# EAGLE design board (EAGLE 6.4)
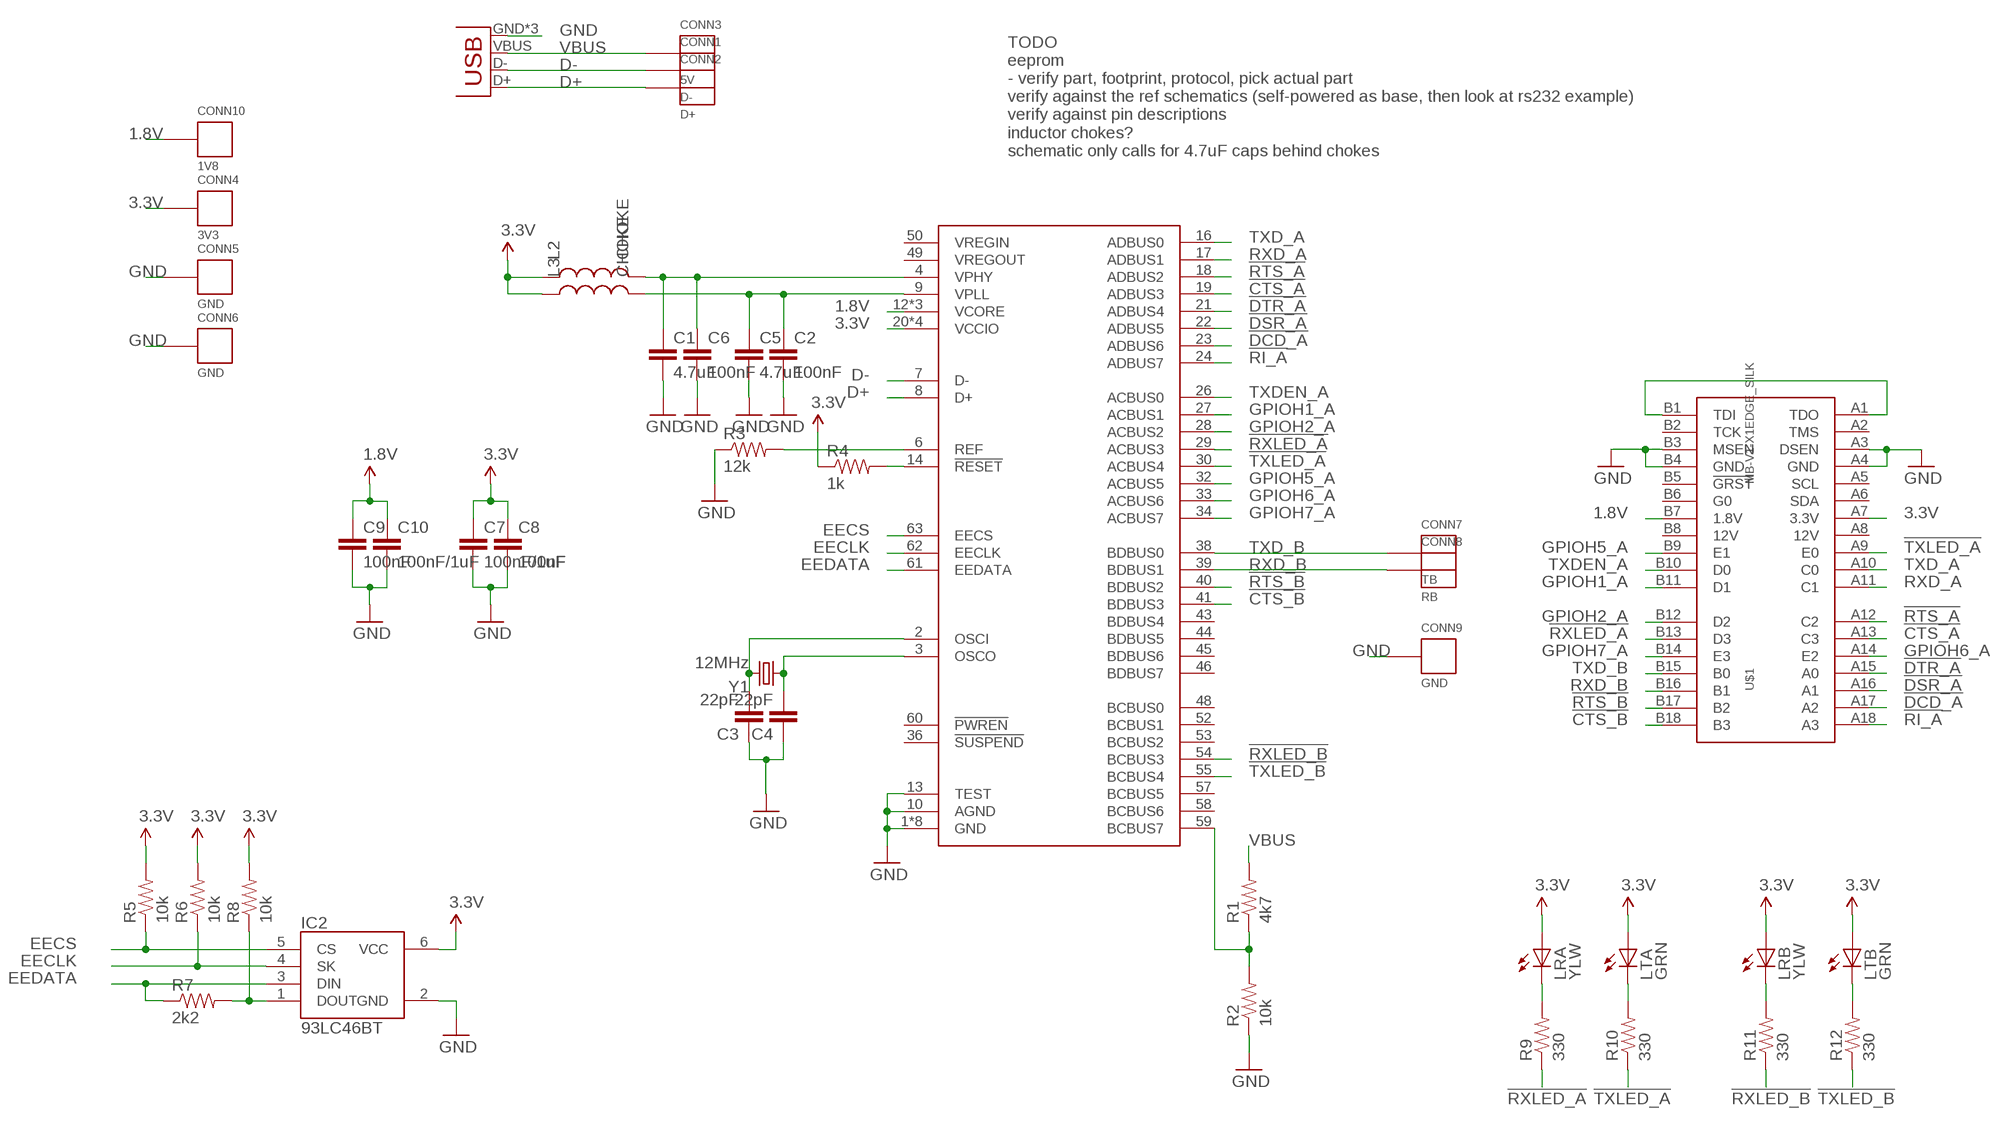
[diagram p0: schematic, sheet 1]

## Parts
C1  4.7uF  CAP0805  [0805]
C2  100nF  CAP0402-CAP  [0402-CAP]
C3  22pF  CAP0402-CAP  [0402-CAP]
C4  22pF  CAP0402-CAP  [0402-CAP]
C5  4.7uF  CAP0805  [0805]
C6  100nF  CAP0402-CAP  [0402-CAP]
C7  100nF/1uF  CAP0402-CAP  [0402-CAP]
C8  100nF  CAP0402-CAP  [0402-CAP]
C9  100nF  CAP0402-CAP  [0402-CAP]
C10  100nF/1uF  CAP0402-CAP  [0402-CAP]
CONN1  D-  CONNECTOR1.27  [TESTPAD-1.27]
CONN2  D+  CONNECTOR1.27  [TESTPAD-1.27]
CONN3  5V  CONNECTOR1.27  [TESTPAD-1.27]
CONN4  3V3  CONNECTOR22AWG  [HOLE_22AWG]
CONN5  GND  CONNECTOR22AWG  [HOLE_22AWG]
CONN6  GND  CONNECTORCLIP  [CLIP-AREA]
CONN7  TB  CONNECTOR22AWG  [HOLE_22AWG]
CONN8  RB  CONNECTOR22AWG  [HOLE_22AWG]
CONN9  GND  CONNECTOR22AWG  [HOLE_22AWG]
CONN10  1V8  CONNECTOR22AWG  [HOLE_22AWG]
IC1  FT2232HL  [TQFP64_LONGPAD]
IC2  93LC46BT  93C46SOT23-6  [SOT23-6L]
JP2  USBMICROB  [USB-MICROB]
L2  CHOKE  INDUCTOR0603  [0603]
L3  CHOKE  INDUCTOR0603  [0603]
LRA  YLW  LED0603  [0603_LED]
LRB  YLW  LED0603  [0603_LED]
LTA  GRN  LED0603  [0603_LED]
LTB  GRN  LED0603  [0603_LED]
R1  4k7  RESISTOR0603  [0603-RES]
R2  10k  RESISTOR0603  [0603-RES]
R3  12k  RESISTOR0603  [0603-RES]
R4  1k  RESISTOR0603  [0603-RES]
R5  10k  RESISTOR0603  [0603-RES]
R6  10k  RESISTOR0603  [0603-RES]
R7  2k2  RESISTOR0603  [0603-RES]
R8  10k  RESISTOR0603  [0603-RES]
R9  330  RESISTOR0603  [0603-RES]
R10  330  RESISTOR0603  [0603-RES]
R11  330  RESISTOR0603  [0603-RES]
R12  330  RESISTOR0603  [0603-RES]
U$1  MB-V1-X1EDGE_SILK  [MB-V1-X1-EDGE]
Y1  12MHz  CRYSTALHC49US  [HC49US]

## Nets
1.8V: C9.1 C10.1 CONN10.P IC1.12(VCORE) IC1.37(VCORE) IC1.64(VCORE) U$1.B7(1.8V)
3.3V: C7.1 C8.1 CONN4.P IC1.20(VCCIO) IC1.31(VCCIO) IC1.42(VCCIO) IC1.56(VCCIO) IC2.6(VCC) L2.1 L3.1 LRA.A LRB.A LTA.A LTB.A R4.1 R5.2 R6.2 R8.2 U$1.A7(3.3V)
!CTS_A: IC1.19(ADBUS3) U$1.A13(C3)
!CTS_B: IC1.41(BDBUS3) U$1.B18(B3)
!DCD_A: IC1.23(ADBUS6) U$1.A17(A2)
!DSR_A: IC1.22(ADBUS5) U$1.A16(A1)
!DTR_A: IC1.21(ADBUS4) U$1.A15(A0)
!RI_A: IC1.24(ADBUS7) U$1.A18(A3)
!RTS_A: IC1.18(ADBUS2) U$1.A12(C2)
!RTS_B: IC1.40(BDBUS2) U$1.B17(B2)
!RXLED_A: IC1.29(ACBUS3) R9.1 U$1.B13(D3)
!RXLED_B: IC1.54(BCBUS3) R11.1
!TXLED_A: IC1.30(ACBUS4) R10.1 U$1.A9(E0)
!TXLED_B: IC1.55(BCBUS4) R12.1
D+: CONN2.P IC1.8(D+) JP2.D+
D-: CONN1.P IC1.7(D-) JP2.D-
EECLK: IC1.62(EECLK) IC2.4(SK) R6.1
EECS: IC1.63(EECS) IC2.5(CS) R5.1
EEDATA: IC1.61(EEDATA) IC2.3(DIN) R7.1
GND: C1.2 C2.2 C3.1 C4.1 C5.2 C6.2 C7.2 C8.2 C9.2 C10.2 CONN5.P CONN6.P$1(P) CONN6.P$2(P) CONN9.P IC1.1(GND) IC1.5(GND) IC1.10(AGND) IC1.11(GND) IC1.13(TEST) IC1.15(GND) IC1.25(GND) IC1.35(GND) IC1.47(GND) IC1.51(GND) IC2.2(GND) JP2.GND JP2.MT1(GND) JP2.MT2(GND) R2.1 R3.1 U$1.A3(DSEN) U$1.A4(GND) U$1.B3(MSEN) U$1.B4(GND)
GPIOH1_A: IC1.27(ACBUS1) U$1.B11(D1)
GPIOH2_A: IC1.28(ACBUS2) U$1.B12(D2)
GPIOH5_A: IC1.32(ACBUS5) U$1.B9(E1)
GPIOH6_A: IC1.33(ACBUS6) U$1.A14(E2)
GPIOH7_A: IC1.34(ACBUS7) U$1.B14(E3)
N$1: C3.2 IC1.2(OSCI) Y1.2
N$2: C4.2 IC1.3(OSCO) Y1.1
N$3: IC1.59(BCBUS7) R1.1 R2.2
N$4: IC1.6(REF) R3.2
N$5: C1.1 C6.1 IC1.4(VPHY) L2.2
N$6: IC1.14(!RESET) R4.2
N$7: C2.1 C5.1 IC1.9(VPLL) L3.2
N$8: IC2.1(DOUT) R7.2 R8.1
N$9: LRA.C R9.2
N$10: LTA.C R10.2
N$11: LRB.C R11.2
N$12: LTB.C R12.2
N$13: U$1.A1(TDO) U$1.B1(TDI)
RXD_A: IC1.17(ADBUS1) U$1.A11(C1)
RXD_B: CONN8.P IC1.39(BDBUS1) U$1.B16(B1)
TXD_A: IC1.16(ADBUS0) U$1.A10(C0)
TXD_B: CONN7.P IC1.38(BDBUS0) U$1.B15(B0)
TXDEN_A: IC1.26(ACBUS0) U$1.B10(D0)
VBUS: CONN3.P JP2.VBUS R1.2
Unconnected: IC1.36(!SUSPEND) IC1.43(BDBUS4) IC1.44(BDBUS5) IC1.45(BDBUS6) IC1.46(BDBUS7) IC1.48(BCBUS0) IC1.49(VREGOUT) IC1.50(VREGIN) IC1.52(BCBUS1) IC1.53(BCBUS2) IC1.57(BCBUS5) IC1.58(BCBUS6) IC1.60(!PWREN) U$1.A2(TMS) U$1.A5(SCL) U$1.A6(SDA) U$1.A8(12V) U$1.B2(TCK) U$1.B5(!GRST) U$1.B6(G0) U$1.B8(12V)

## Notes on the sheet
- TODO
  eeprom
  - verify part, footprint, protocol, pick actual part
  verify against the ref schematics (self-powered as base, then look at rs232 example)
  verify against pin descriptions
  inductor chokes?
  schematic only calls for 4.7uF caps behind chokes

## Library data of the parts
C1-C10 = kmod-passives:CAP: Capacitor Standard 0603 ceramic capacitor, and 0.1" leaded capacitor.
CONN1-CONN10 = kmod-nonparts:CONNECTOR: Collection of holes/pads for testing/connecting
IC1 = kmod-testing:FT2232H
IC2 = kmod-testing:93C46: Not sure how standard the SOT23-6 pinout is.
JP2 = kmod-connectors:USB: USB Connectors Got from SparkFun, removed all but MICROB. Used that successfully. no mounting holes; PROD_ID: CONN-09505
L2 L3 = kmod-passives:INDUCTOR
LRA LRB LTA LTB = kmod-passives:LED
R1-R12 = kmod-passives:RESISTOR: Resistor Basic schematic elements and footprints for 0603, 1206, and PTH resistors.
U$1 = kmod-connectors:MB-V1-X1
Y1 = kmod-mechanical:CRYSTAL: Various standard crystals. Proven footprints. Spark Fun Electronics SKU : COM-00534

## Board
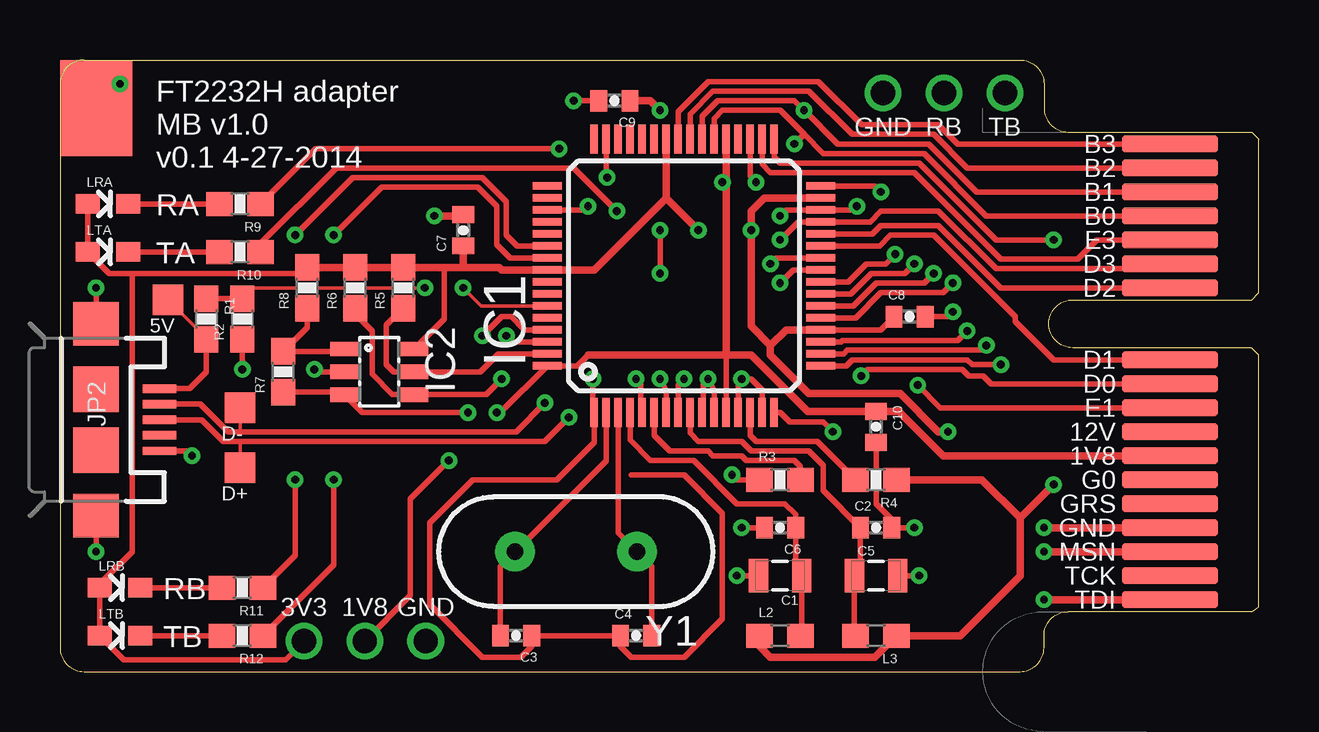
[diagram p1: board, top side]
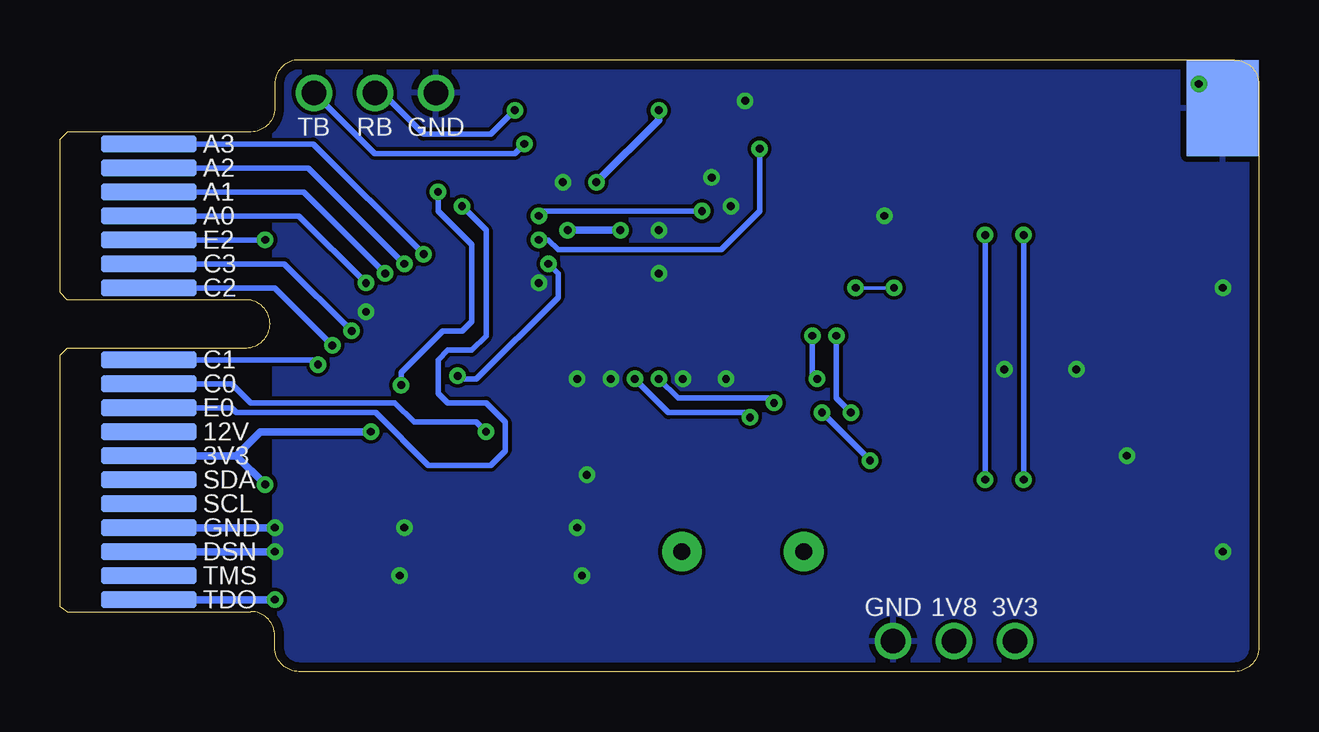
[diagram p2: board, bottom side, seen from below]

Size 49.95 x 25.5 mm. Coordinates in mm from the lower left corner, seen from the top.
Outline: 42,22.5 arc-90 41,23.5 41,24.5 arc90 40,25.5 1,25.5 arc90 0,24.5 0,1 arc90 1,0 40,0 arc90 41,1 41,1.5 arc-90 42,2.5
Copper layers (1*16): Top 0.0356mm / dielectric 1.5011mm / Bottom 0.0356mm
Design rules "OSHPark_mine": minimum track width 6mil, minimum drill 13mil, track to track 6mil, track to pad 6mil, pad to pad 6mil, via to via 6mil, smd to smd 6mil, copper to edge 15mil, drill to drill 6mil, minimum pad ring 7mil, minimum via ring 7mil, stop-mask expansion 2mil, vias tented up to drill 13mil, thermal gap 10mil

### Footprints (pad centres in the part's own frame; a part is rotated, then mirrored left to right if it is on the bottom)
0805 = smd 0.8 x 1.4: 1 -0.9,0; 2 0.9,0
0402-CAP = smd 0.7 x 0.9: 1 -0.65,0; 2 0.65,0
TESTPAD-1.27 = smd 1.27 x 1.27: P 0,0
HOLE_22AWG = drill 1.016: P 0,0
CLIP-AREA = smd 4 x 3: P$1 0,0 | smd 4 x 3 bottom: P$2 0,0
TQFP64_LONGPAD = smd 1.2 x 0.3: 1 -5.7,3.75; 2 -5.7,3.25; 3 -5.7,2.75; 4 -5.7,2.25; 5 -5.7,1.75; 6 -5.7,1.25; 7 -5.7,0.75; 8 -5.7,0.25; 9 -5.7,-0.25; 10 -5.7,-0.75; 11 -5.7,-1.25; 12 -5.7,-1.75; 13 -5.7,-2.25; 14 -5.7,-2.75; 15 -5.7,-3.25; 16 -5.7,-3.75; 33 5.7,-3.75; 34 5.7,-3.25; 35 5.7,-2.75; 36 5.7,-2.25; 37 5.7,-1.75; 38 5.7,-1.25; 39 5.7,-0.75; 40 5.7,-0.25; 41 5.7,0.25; 42 5.7,0.75; 43 5.7,1.25; 44 5.7,1.75; 45 5.7,2.25; 46 5.7,2.75; 47 5.7,3.25; 48 5.7,3.75 | smd 0.3 x 1.2: 17 -3.75,-5.7; 18 -3.25,-5.7; 19 -2.75,-5.7; 20 -2.25,-5.7; 21 -1.75,-5.7; 22 -1.25,-5.7; 23 -0.75,-5.7; 24 -0.25,-5.7; 25 0.25,-5.7; 26 0.75,-5.7; 27 1.25,-5.7; 28 1.75,-5.7; 29 2.25,-5.7; 30 2.75,-5.7; 31 3.25,-5.7; 32 3.75,-5.7; 49 3.75,5.7; 50 3.25,5.7; 51 2.75,5.7; 52 2.25,5.7; 53 1.75,5.7; 54 1.25,5.7; 55 0.75,5.7; 56 0.25,5.7; 57 -0.25,5.7; 58 -0.75,5.7; 59 -1.25,5.7; 60 -1.75,5.7; 61 -2.25,5.7; 62 -2.75,5.7; 63 -3.25,5.7; 64 -3.75,5.7
SOT23-6L = smd 0.6 x 1.2: 1 -0.95,-1.45; 2 0,-1.45; 3 0.95,-1.45; 4 0.95,1.45; 5 0,1.45; 6 -0.95,1.45
USB-MICROB = smd 0.35 x 1.4: D+ 0,2.65; D- -0.65,2.65; GND 1.3,2.65; ID 0.65,2.65; VBUS -1.3,2.65 | smd 1.8 x 1.9: MT1 -4,0; MT2 4,0 | smd 1.9 x 1.9: P$1 -1.27,0; P$2 1.27,0
0603 = smd 1.1 x 1: 1 -0.85,0; 2 0.85,0
0603_LED = smd 0.8 x 1.003: A 0,-0.852; C 0,0.852
0603-RES = smd 1.1 x 1: 1 -0.85,0; 2 0.85,0
MB-V1-X1-EDGE = smd 0.7 x 4 bottom: A1 -11.5,-0.75; A2 -10.5,-0.75; A3 -9.5,-0.75; A4 -8.5,-0.75; A5 -7.5,-0.75; A6 -6.5,-0.75; A7 -5.5,-0.75; A8 -4.5,-0.75; A9 -3.5,-0.75; A10 -2.5,-0.75; A11 -1.5,-0.75; A12 1.5,-0.75; A13 2.5,-0.75; A14 3.5,-0.75; A15 4.5,-0.75; A16 5.5,-0.75; A17 6.5,-0.75; A18 7.5,-0.75 | smd 0.7 x 4: B1 -11.5,-0.75; B2 -10.5,-0.75; B3 -9.5,-0.75; B4 -8.5,-0.75; B5 -7.5,-0.75; B6 -6.5,-0.75; B7 -5.5,-0.75; B8 -4.5,-0.75; B9 -3.5,-0.75; B10 -2.5,-0.75; B11 -1.5,-0.75; B12 1.5,-0.75; B13 2.5,-0.75; B14 3.5,-0.75; B15 4.5,-0.75; B16 5.5,-0.75; B17 6.5,-0.75; B18 7.5,-0.75
HC49US = drill 0.7 pad 1.651: 1 -2.54,0; 2 2.54,0

### Placement (x,y rotation side)
C1  30,4 180 top
C2  34,6 0 top
C3  19,1.5 180 top
C4  24,1.5 0 top
C5  34,4 0 top
C6  30,6 180 top
C7  16.8,18.4 90 top
C8  35.4,14.8 0 top
C9  23.1,23.8 180 top
C10  34,10.2 270 top
CONN1  7.5,11 0 top
CONN2  7.5,8.5 0 top
CONN3  4.5,15.5 0 top
CONN4  10.16,1.27 180 top
CONN5  15.24,1.27 180 top
CONN6  1.5,23.5 90 top
CONN7  39.37,24.13 0 top
CONN8  36.83,24.13 0 top
CONN9  34.29,24.13 0 top
CONN10  12.7,1.27 180 top
IC1  26,16.5 90 top
IC2  13.3,12.5 270 top
JP2  1.5,10.5 270 top
L2  30,1.5 0 top
L3  34,1.5 180 top
LRA  2,19.5 270 top
LRB  2.5,3.5 270 top
LTA  2,17.5 270 top
LTB  2.5,1.5 270 top
R1  6.1,14.7 270 top
R2  7.6,14.7 90 top
R3  30,8 0 top
R4  34,8 180 top
R5  14.3,16 90 top
R6  12.3,16 90 top
R7  9.3,12.5 90 top
R8  10.3,16 90 top
R9  7.5,19.5 180 top
R10  7.5,17.5 180 top
R11  7.6,3.5 180 top
R12  7.6,1.5 180 top
U$1  45.5,14.5 90 top
Y1  21.5,5 180 top

### Tracks (layer width: path | path; a pad name or v marks a point on that pad's centre or on a via)
1.8V  (via drill 0.33)
  Top 0.229: IC1.12 27.75,13.15 27.8,13.2 | 22,13.2 21.55,12.75 IC1.64 18.35,10.8 v18.2,10.8 | v16.2,8.8 14.6,7.2 14.6,3.17 CONN10.P
  Top 0.305: U$1.B7 36.8,9 34.95,10.85 C10.1 31.15,10.85 28.8,13.2 27.8,13.2 | 27.8,13.2 22,13.2 | 27.8,13.2 27.75,13.25 27.75,20.47 | IC1.37 27.75,20.47 | 27.75,20.47 27.68,20.4 v27.6,20.4 | v25,23.4 24.6,23.8 C9.1
  Bottom 0.229: v18.2,10.8 v16.2,8.8
  Bottom 0.305: v27.6,20.4 25,23 v25,23.4
3.3V  (via drill 0.33)
  Top 0.229: IC1.20 34.2,14.25 C8.1 | IC2.6 16.01,14.71 16.01,16.84 | LRA.A LTA.A 2.05,16.6 3,16.6 | R8.2 10.05,16.6 3,16.6 | 3,16.6 3,5 1.65,3.65 LRB.A LTB.A 2.65,0.5 9.4,0.5 CONN4.P
  Top 0.305: IC1.20 30.25,14.25 29.6,13.6 | 29.6,13.6 29.6,13.2 31.2,11.6 35,11.6 36.6,10 v37,10 | v41.4,7.8 40,6.4 | 40,6.4 40,4 37.5,1.5 L3.1 33.95,0.6 29.6,0.6 29.15,1.05 L2.1 | 29.6,13.6 28.8,14.4 v28.8,18.4 28.8,19.2 29.35,19.75 IC1.31 | v26.6,18.4 25.25,19.75 | 25.25,19.75 IC1.42 | 25.25,19.75 22.25,16.75 IC1.56 18.4,16.75 18.31,16.84 16.8,16.84 | R8.2 R6.2 R5.2 15.7,16.85 16.01,16.84 16.8,16.84 | 40,6.4 38.4,8 R4.1 | C7.1 16.8,16.84
  Bottom 0.305: 42.6,9 U$1.A7 | 42.6,9 v41.4,7.8 | v28.8,18.4 v26.6,18.4 | 42.6,9 41.6,10 v37,10
!CTS_A  (via drill 0.33)
  Top 0.229: IC1.19 32.55,13.75 32.6,13.8 37.4,13.8 v37.8,14.2
  Bottom 0.229: v37.8,14.2 40.6,17 U$1.A13
!CTS_B
  Top 0.229: IC1.41 25.75,23.35 27,24.6 31.6,24.6 33.4,22.8 36.6,22.8 37.4,22 U$1.B18
!DCD_A  (via drill 0.33)
  Top 0.229: IC1.23 32.95,15.75 33.8,16.6 35.2,16.6 v35.6,17
  Bottom 0.229: U$1.A17 39.6,21 v35.6,17
!DSR_A  (via drill 0.33)
  Top 0.229: IC1.22 33.05,15.25 34,16.2 36,16.2 v36.4,16.6
  Bottom 0.229: U$1.A16 39.8,20 v36.4,16.6
!DTR_A  (via drill 0.33)
  Top 0.229: IC1.21 33.15,14.75 34.2,15.8 36.8,15.8 v37.2,16.2
  Bottom 0.229: U$1.A15 40,19 v37.2,16.2
!RI_A  (via drill 0.33)
  Top 0.229: IC1.24 32.85,16.25 33.6,17 34.4,17 v34.8,17.4
  Bottom 0.229: U$1.A18 39.4,22 v34.8,17.4
!RTS_A  (via drill 0.33)
  Top 0.229: IC1.18 32.65,13.25 32.8,13.4 38.4,13.4 v38.6,13.6
  Bottom 0.229: v38.6,13.6 41,16 U$1.A12
!RTS_B
  Top 0.229: IC1.40 26.25,23.25 27.2,24.2 31.2,24.2 33,22.4 36.4,22.4 37.8,21 U$1.B17
!RXLED_A  (via drill 0.33)
  Top 0.229: U$1.B13 46.05,16.8 39,16.8 36.6,19.2 34.2,19.2 33.75,18.75 IC1.29 30.75,18.75 v30,18 | R9.1 10.65,21.8 v20.8,21.8
  Bottom 0.229: v20.8,21.8 20.8,19.2 22.4,17.6 29.2,17.6 29.6,18 v30,18
!RXLED_B  (via drill 0.33)
  Top 0.229: v9.8,18.2 12.2,20.6 17.6,20.6 18.6,19.6 18.6,18.2 19.05,17.75 IC1.54 | v9.8,8 9.8,4.85 R11.1
  Bottom 0.229: v9.8,8 v9.8,18.2
!TXLED_A  (via drill 0.33)
  Top 0.229: v23.2,19.2 21.4,21 11.5,21 8.35,17.85 R10.1 | v30,19 30.25,19.25 IC1.30 33.05,19.25 v33.2,19.4
  Bottom 0.229: v23.2,19.2 29.8,19.2 v30,19 | v33.2,19.4 32.2,18.4 32.2,14 32.8,13.4 33.8,13.4 34.2,13 34.2,11.6 33.8,11.2 32.2,11.2 31.4,10.4 31.4,9.2 32,8.6 34.6,8.6 36.8,10.8 42.6,10.8 42.8,11 U$1.A9
!TXLED_B  (via drill 0.33)
  Top 0.229: v11.4,18.2 13.4,20.2 17.4,20.2 18.2,19.4 18.2,17.8 18.75,17.25 IC1.55 | v11.4,8 11.4,4.45 R12.1
  Bottom 0.229: v11.4,8 v11.4,18.2
D+  (via drill 0.33)
  Top 0.152: CONN2.P 7.5,9.6
  Top 0.229: JP2.D+ 5.9,10.5 6.8,9.6 7.5,9.6 20.2,9.6 v21.2,10.6 | IC1.8 25.75,11.95 v26,12.2
  Bottom 0.229: v26,12.2 24.6,10.8 21.4,10.8 v21.2,10.6
D-  (via drill 0.33)
  Top 0.152: CONN1.P 7.5,10
  Top 0.229: JP2.D- 5.85,11.15 7,10 7.5,10 19,10 v20.2,11.2 | IC1.7 25.25,11.75 v25,12.2
  Bottom 0.229: v20.2,11.2 20.4,11.4 24.2,11.4 v25,12.2
EECLK  (via drill 0.33)
  Top 0.229: R6.1 12.3,14.9 13,14.2 13,12.4 13.85,11.55 IC2.4 17.75,11.55 v18.4,12.2 | IC1.62 18.85,13.75 v18.6,14
  Bottom 0.229: v18.4,12.2 18.6,12.4 v18.6,14
EECS
  Top 0.229: R5.1 13.6,14.45 13.6,12.8 13.9,12.5 IC2.5 17.5,12.5 18.25,13.25 IC1.63
EEDATA  (via drill 0.33)
  Top 0.229: R7.1 11.75,11.65 IC2.3 12.6,10.8 v17,10.8 | IC1.61 19.35,14.25 18.8,14.8 18.4,14.8 v17.6,14
  Bottom 0.229: v17.6,14 17.6,11.4 v17,10.8
GND  (via drill 0.33)
  Top 0.152: CONN6.P$1 v2.5,24.5
  Top 0.229: JP2.MT1 v1.5,16 | JP2.MT2 v1.5,5 | JP2.GND 5.3,9.2 v5.5,9 | 23.8,8.2 26,8.2 27.6,6.6 27.6,2.2 26,0.6 23.8,0.6 23.35,1.05 C4.1 C3.1 19.65,1.05 19.2,0.6 17.6,0.6 15.4,2.8 15.4,6.2 17.2,8 20.7,8 22.25,9.55 IC1.1 22.2,10.85 v22.2,12.2 | IC2.2 10.7,12.5 v10.6,12.6 | IC1.5 24.2,10.85 24.2,12 v24,12.2 | IC1.10 26.8,10.85 26.8,12 v27,12.2 27.25,11.75 IC1.11 | IC1.13 28.25,12.05 v28.4,12.2 28.8,12.2 29.25,11.75 IC1.15 | IC1.35 28.75,20.65 v29,20.4 | IC1.47 22.75,20.65 v22.8,20.6 | IC1.51 21.85,19.25 v22,19.4 | R2.1 v7.6,12.6 | C5.2 v35.8,4 | v35.6,6 C2.2 34.65,6.35 34,7 C10.2 | C6.2 v28.4,6 | C1.2 v28.2,4 | R3.1 28.2,8 v28,8.2 | C8.2 37,14.8 v37.2,15 | v25,18.4 v25,16.6 | IC1.25 30.55,16.75 v30,16.2 | C9.2 v21.4,23.8
  Top 0.305: U$1.B3 v41,5 | U$1.B4 v41,6 | C7.2 16.75,19 v15.6,19
  Bottom 0.152: CONN6.P$1 v2.5,24.5
  Bottom 0.305: v41,6 U$1.B4 | v41,5 U$1.B3
  pour Bottom: 0,25.5 41,25.5 41,0 0,0
GPIOH1_A
  Top 0.229: IC1.27 34.15,17.75 34.6,18.2 36.4,18.2 39.8,14.8 39.8,14.6 41.4,13 U$1.B11
GPIOH2_A
  Top 0.229: U$1.B12 39.2,16 36.6,18.6 34.2,18.6 33.85,18.25 IC1.28
GPIOH5_A  (via drill 0.33)
  Top 0.229: IC1.32 33.95,20.25 v34.2,20 | v35.74,11.94 36.68,11 U$1.B9
  Bottom 0.229: v34.2,20 34.2,19.2 32.8,17.8 32.8,14.6 33.2,14.2 34,14.2 35.74,12.46 v35.74,11.94
GPIOH6_A  (via drill 0.33)
  Top 0.229: IC1.33 29.75,21.45 30,21.2 35.8,21.2 39,18 v41.4,18
  Bottom 0.229: v41.4,18 U$1.A14
GPIOH7_A
  Top 0.229: IC1.34 29.25,21.15 29.6,20.8 35.6,20.8 39.2,17.2 42.4,17.2 43.2,18 U$1.B14
N$1
  Top 0.229: C3.2 18.35,4.39 Y1.2 22.75,8.79 IC1.2
N$2
  Top 0.229: C4.2 24.65,4.39 Y1.1 23.25,5.79 IC1.3
N$3  (via drill 0.33)
  Top 0.152: R2.2 8.05,16 v15.2,16 | v16.8,16 17.55,15.25 IC1.59
  Top 0.229: R1.1 R2.2
  Bottom 0.152: v15.2,16 v16.8,16
N$4
  Top 0.229: R3.2 30.85,8.55 30.6,8.8 28.6,8.8 28.4,9 27.2,9 27,9.2 25.4,9.2 24.75,9.85 IC1.6
N$5
  Top 0.229: IC1.4 23.75,9.65 24.6,8.8 26.4,8.8 28.2,7 30.2,7 30.65,6.55 C6.1 30.65,4.25 C1.1 30.9,1.55 L2.2
N$6
  Top 0.229: IC1.14 28.75,9.85 29,9.6 31.55,9.6 R4.2
N$7
  Top 0.229: L3.2 33.1,1.55 C5.1 33.35,4.25 C2.1 31.8,7.55 31.8,8.6 31.2,9.2 28.8,9.2 28.4,9.6 26.6,9.6 26.25,9.95 IC1.9
N$8
  Top 0.229: IC2.1 11.75,13.35 R7.2 10.3,14.35 R8.1
N$9
  Top 0.229: LRA.C R9.2
N$10
  Top 0.229: LTA.C R10.2
N$11
  Top 0.229: LRB.C R11.2
N$12
  Top 0.229: R12.2 LTB.C
N$13  (via drill 0.33)
  Top 0.305: v41,3 U$1.A1
  Bottom 0.305: U$1.A1 v41,3
RXD_A  (via drill 0.33)
  Top 0.229: IC1.17 32.75,12.75 33,13 37.8,13 38,12.8 v39.2,12.8
  Bottom 0.229: v39.2,12.8 39.4,13 U$1.A11
RXD_B  (via drill 0.33)
  Top 0.229: IC1.39 26.75,23.15 27.4,23.8 30.6,23.8 v31,23.4 32.4,22 36.2,22 38.2,20 U$1.B16
  Bottom 0.229: CONN8.P 36.53,24.13 34.8,22.4 32,22.4 v31,23.4
TXD_A  (via drill 0.33)
  Top 0.229: IC1.16 30,10.8 30.4,10.4 31.8,10.4 v32.2,10
  Bottom 0.229: v32.2,10 32.6,10.4 35.2,10.4 36,11.2 42,11.2 42.8,12 U$1.A10
TXD_B  (via drill 0.33)
  Top 0.229: IC1.38 27.25,23.05 27.6,23.4 30,23.4 31,22.4 | U$1.B15 38.6,19 36,21.6 31.8,21.6 31,22.4 | 31,22.4 v30.6,22
  Bottom 0.229: v30.6,22 31,21.6 36.84,21.6 CONN7.P
TXDEN_A  (via drill 0.33)
  Top 0.229: IC1.26 29.85,17.25 v29.6,17 | U$1.B10 38.8,12 38.47,12.33 37.87,12.33 37.6,12.6 33.65,12.6 v33.38,12.33
  Bottom 0.229: v29.6,17 29.2,16.6 29.2,15.6 32.6,12.2 33.2,12.2 v33.38,12.33
VBUS
  Top 0.152: CONN3.P 6.1,13.9 R1.2
  Top 0.229: JP2.VBUS 5.4,11.8 6.1,12.5 R1.2

### Text on the board
tPlace: FT2232H adapter / MB v1.0 / v0.1 4-27-2014 | RA | TA | RB | TB